# Altium schematic sheet PIC.SchDoc
size A
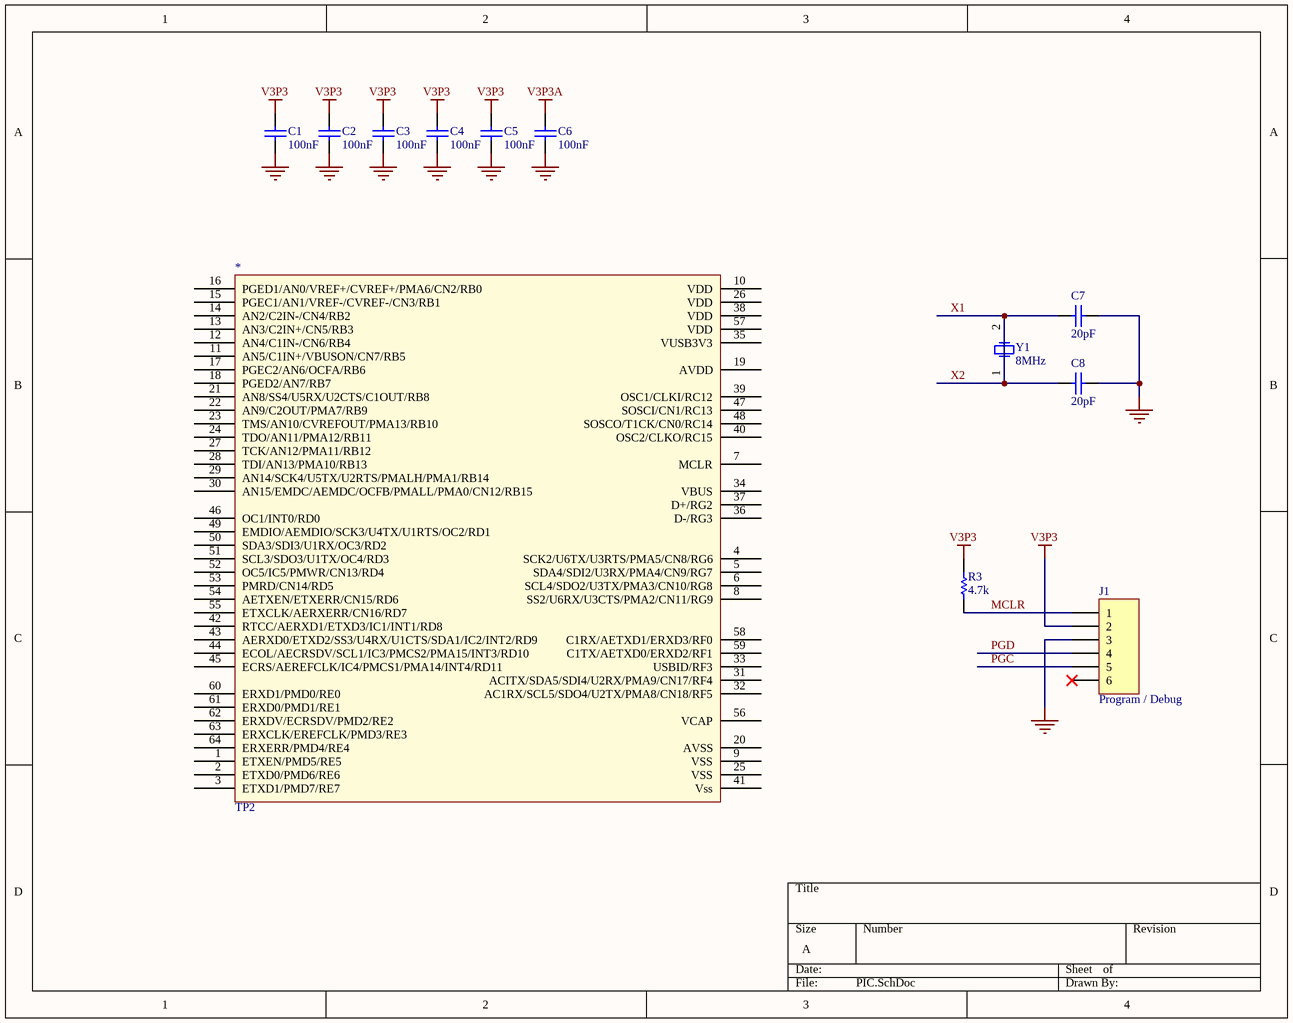
[diagram p0: PIC.SchDoc]

## Parts
*  TP2
C1  100nF  [CAPC1608N]
C2  100nF  [CAPC1608N]
C3  100nF  [CAPC1608N]
C4  100nF  [CAPC1608N]
C5  100nF  [CAPC1608N]
C6  100nF  [CAPC1608N]
C7  20pF  [CAPC1005N]
C8  20pF  [CAPC1005N]
J1  Program / Debug  [MOLEX 6P 1.25 CMS]
R3  4.7k  [RESC1608N]
Y1  8MHz  [XTAL139X50X45]

## Nets
GND: C1.1 C2.1 C3.1 C4.1 C5.1 C6.1 C7.2 C8.2 J1.3
V3P3: C1.2 C2.2 C3.2 C4.2 C5.2 J1.2 R3.2
V3P3A: C6.2
MCLR: J1.1 R3.1
PGC: J1.5
PGD: J1.4
X1: C7.1 C8.1 Y1.1(OSC1) Y1.2(OSC2)  [also labelled X2]

Not connected (* = marked no-connect by the designer): * 1(ETXEN/PMD5/RE5) 2(ETXD0/PMD6/RE6) 3(ETXD1/PMD7/RE7) 4(SCK2/U6TX/U3RTS/PMA5/CN8/RG6) 5(SDA4/SDI2/U3RX/PMA4/CN9/RG7) 6(SCL4/SDO2/U3TX/PMA3/CN10/RG8) 7(MCLR) 8(SS2/U6RX/U3CTS/PMA2/CN11/RG9) 9(VSS) 10(VDD) 11(AN5/C1IN+/VBUSON/CN7/RB5) 12(AN4/C1IN-/CN6/RB4) 13(AN3/C2IN+/CN5/RB3) 14(AN2/C2IN-/CN4/RB2) 15(PGEC1/AN1/VREF-/CVREF-/CN3/RB1) 16(PGED1/AN0/VREF+/CVREF+/PMA6/CN2/RB0) 17(PGEC2/AN6/OCFA/RB6) 18(PGED2/AN7/RB7) 19(AVDD) 20(AVSS) 21(AN8/SS4/U5RX/U2CTS/C1OUT/RB8) 22(AN9/C2OUT/PMA7/RB9) 23(TMS/AN10/CVREFOUT/PMA13/RB10) 24(TDO/AN11/PMA12/RB11) 25(VSS) 26(VDD) 27(TCK/AN12/PMA11/RB12) 28(TDI/AN13/PMA10/RB13) 29(AN14/SCK4/U5TX/U2RTS/PMALH/PMA1/RB14) 30(AN15/EMDC/AEMDC/OCFB/PMALL/PMA0/CN12/RB15) 31(ACITX/SDA5/SDI4/U2RX/PMA9/CN17/RF4) 32(AC1RX/SCL5/SDO4/U2TX/PMA8/CN18/RF5) 33(USBID/RF3) 34(VBUS) 35(VUSB3V3) 36(D-/RG3) 37(D+/RG2) 38(VDD) 39(OSC1/CLKI/RC12) 40(OSC2/CLKO/RC15) 41(Vss) 42(RTCC/AERXD1/ETXD3/IC1/INT1/RD8) 43(AERXD0/ETXD2/SS3/U4RX/U1CTS/SDA1/IC2/INT2/RD9) 44(ECOL/AECRSDV/SCL1/IC3/PMCS2/PMA15/INT3/RD10) 45(ECRS/AEREFCLK/IC4/PMCS1/PMA14/INT4/RD11) 46(OC1/INT0/RD0) 47(SOSCI/CN1/RC13) 48(SOSCO/T1CK/CN0/RC14) 49(EMDIO/AEMDIO/SCK3/U4TX/U1RTS/OC2/RD1) 50(SDA3/SDI3/U1RX/OC3/RD2) 51(SCL3/SDO3/U1TX/OC4/RD3) 52(OC5/IC5/PMWR/CN13/RD4) 53(PMRD/CN14/RD5) 54(AETXEN/ETXERR/CN15/RD6) 55(ETXCLK/AERXERR/CN16/RD7) 56(VCAP) 57(VDD) 58(C1RX/AETXD1/ERXD3/RF0) 59(C1TX/AETXD0/ERXD2/RF1) 60(ERXD1/PMD0/RE0) 61(ERXD0/PMD1/RE1) 62(ERXDV/ECRSDV/PMD2/RE2) 63(ERXCLK/EREFCLK/PMD3/RE3) 64(ERXERR/PMD4/RE4); J1 6*

## Library data of the parts
C1-C6 = Cap: Capacitor; Value: 100pF; Published: 8-Jun-2000; LatestRevisionDate: 17-Jul-2002; LatestRevisionNote: Re-released for DXP Platform.; PackageReference: RAD-0.3; Publisher: Altium Limited; PackageDescription: Radial Cap, Thru-Hole; 2 Leads; 0.3 in Pin Spacing
C7 = Cap: Capacitor; Value: 100pF; Precision: 50V X5R; Published: 8-Jun-2000; LatestRevisionDate: 17-Jul-2002; LatestRevisionNote: Re-released for DXP Platform.; PackageReference: RAD-0.3; Publisher: Altium Limited; PackageDescription: Radial Cap, Thru-Hole; 2 Leads; 0.3 in Pin Spacing
C8 = Cap: Capacitor; Precision: 50V X5R; Published: 8-Jun-2000; LatestRevisionDate: 17-Jul-2002; LatestRevisionNote: Re-released for DXP Platform.; PackageReference: RAD-0.3; Publisher: Altium Limited; PackageDescription: Radial Cap, Thru-Hole; 2 Leads; 0.3 in Pin Spacing
J1 = Header 6H: Header, 6-Pin, Right Angle; Fabricant: Molex; RefFabricant: 53398-0671; Fournisseur: Farnell; RefFournisseur: 1125368; LatestRevisionDate: 17-Jul-2002; LatestRevisionNote: Re-released for DXP Platform.; Publisher: Altium Limited
R3 = Res1: Resistor; Value: 1K; Precision: 1%; Published: 8-Jun-2000; LatestRevisionDate: 17-Jul-2002; LatestRevisionNote: Re-released for DXP Platform.; PackageReference: AXIAL-0.3; Publisher: Altium Limited; PackageDescription: Axial Device, Thru-Hole; 2 Leads; 0.3 in Pin Spacing
Y1 = XTAL: Crystal Oscillator; Fabricant: FOX ELECTRONICS; RefFabricant: FOXSDLF/080-20; Fournisseur: Farnell; RefFournisseur: 2063972; Published: 8-Jun-2000; LatestRevisionDate: 17-Jul-2002; LatestRevisionNote: Re-released for DXP Platform.; PackageReference: R38; Publisher: Altium Limited; PackageDescription: Crystal, Thru-Hole; 2 Leads; Body 3.1 x 8.2 mm (Dia.xH)